# Altium schematic sheet Ethernet Overview.SchDoc
size A4; DocumentNumber: 2; SheetNumber: 2; SheetTotal: 12
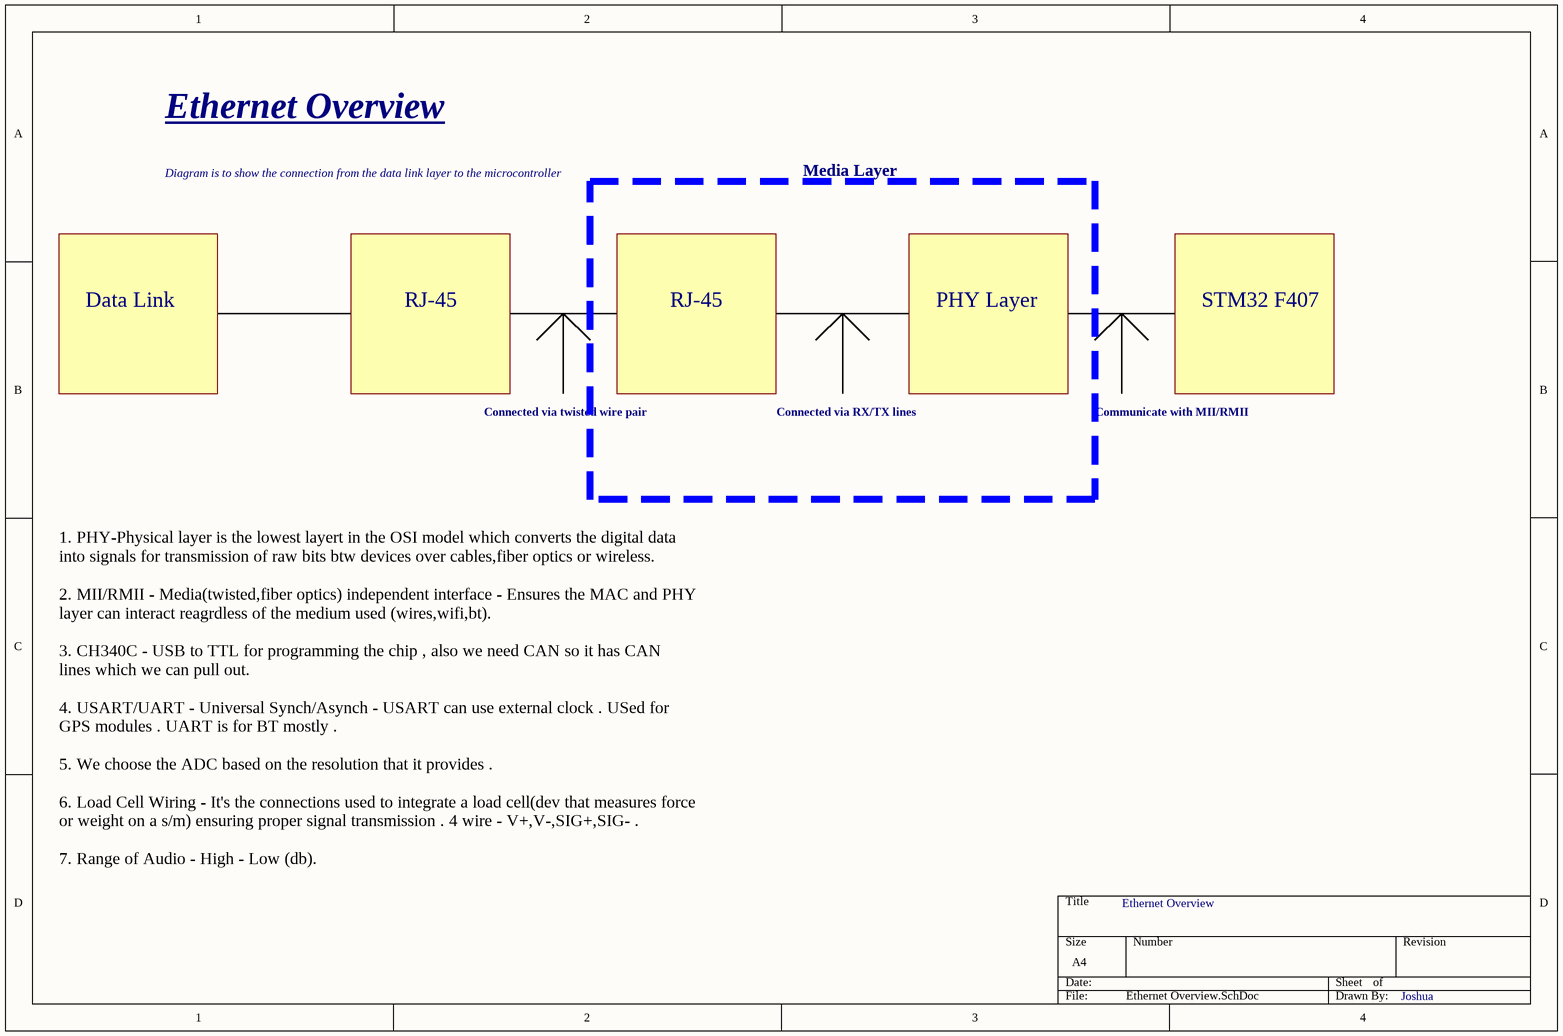
[diagram p0: Ethernet Overview.SchDoc]

## Notes on the sheet
- Ethernet Overview
- Diagram is to show the connection from the data link layer to the microcontroller
- Media Layer
- Data Link
- RJ-45
- PHY Layer
- STM32 F407
- Connected via twisted wire pair
- Connected via RX/TX lines
- Communicate with MII/RMII
- 1. PHY-Physical layer is the lowest layert in the OSI model which converts the digital data into signals for transmission of raw bits btw devices over cables,fiber optics or wireless.
  2. MII/RMII - Media(twisted,fiber optics) independent interface - Ensures the MAC and PHY layer can interact reagrdless of the medium used (wires,wifi,bt).
  3. CH340C - USB to TTL for programming the chip , also we need CAN so it has CAN lines which we can pull out.
  4. USART/UART - Universal Synch/Asynch - USART can use external clock . USed for GPS modules . UART is for BT mostly .
  5. We choose the ADC based on the resolution that it provides .
  6. Load Cell Wiring - It's the connections used to integrate a load cell(dev that measures force or weight on a s/m) ensuring proper signal transmission . 4 wire - V+,V-,SIG+,SIG- .
  7. Range of Audio - High - Low (db).
- Joshua